# EAGLE design Science_Board (EAGLE 6.6.0)
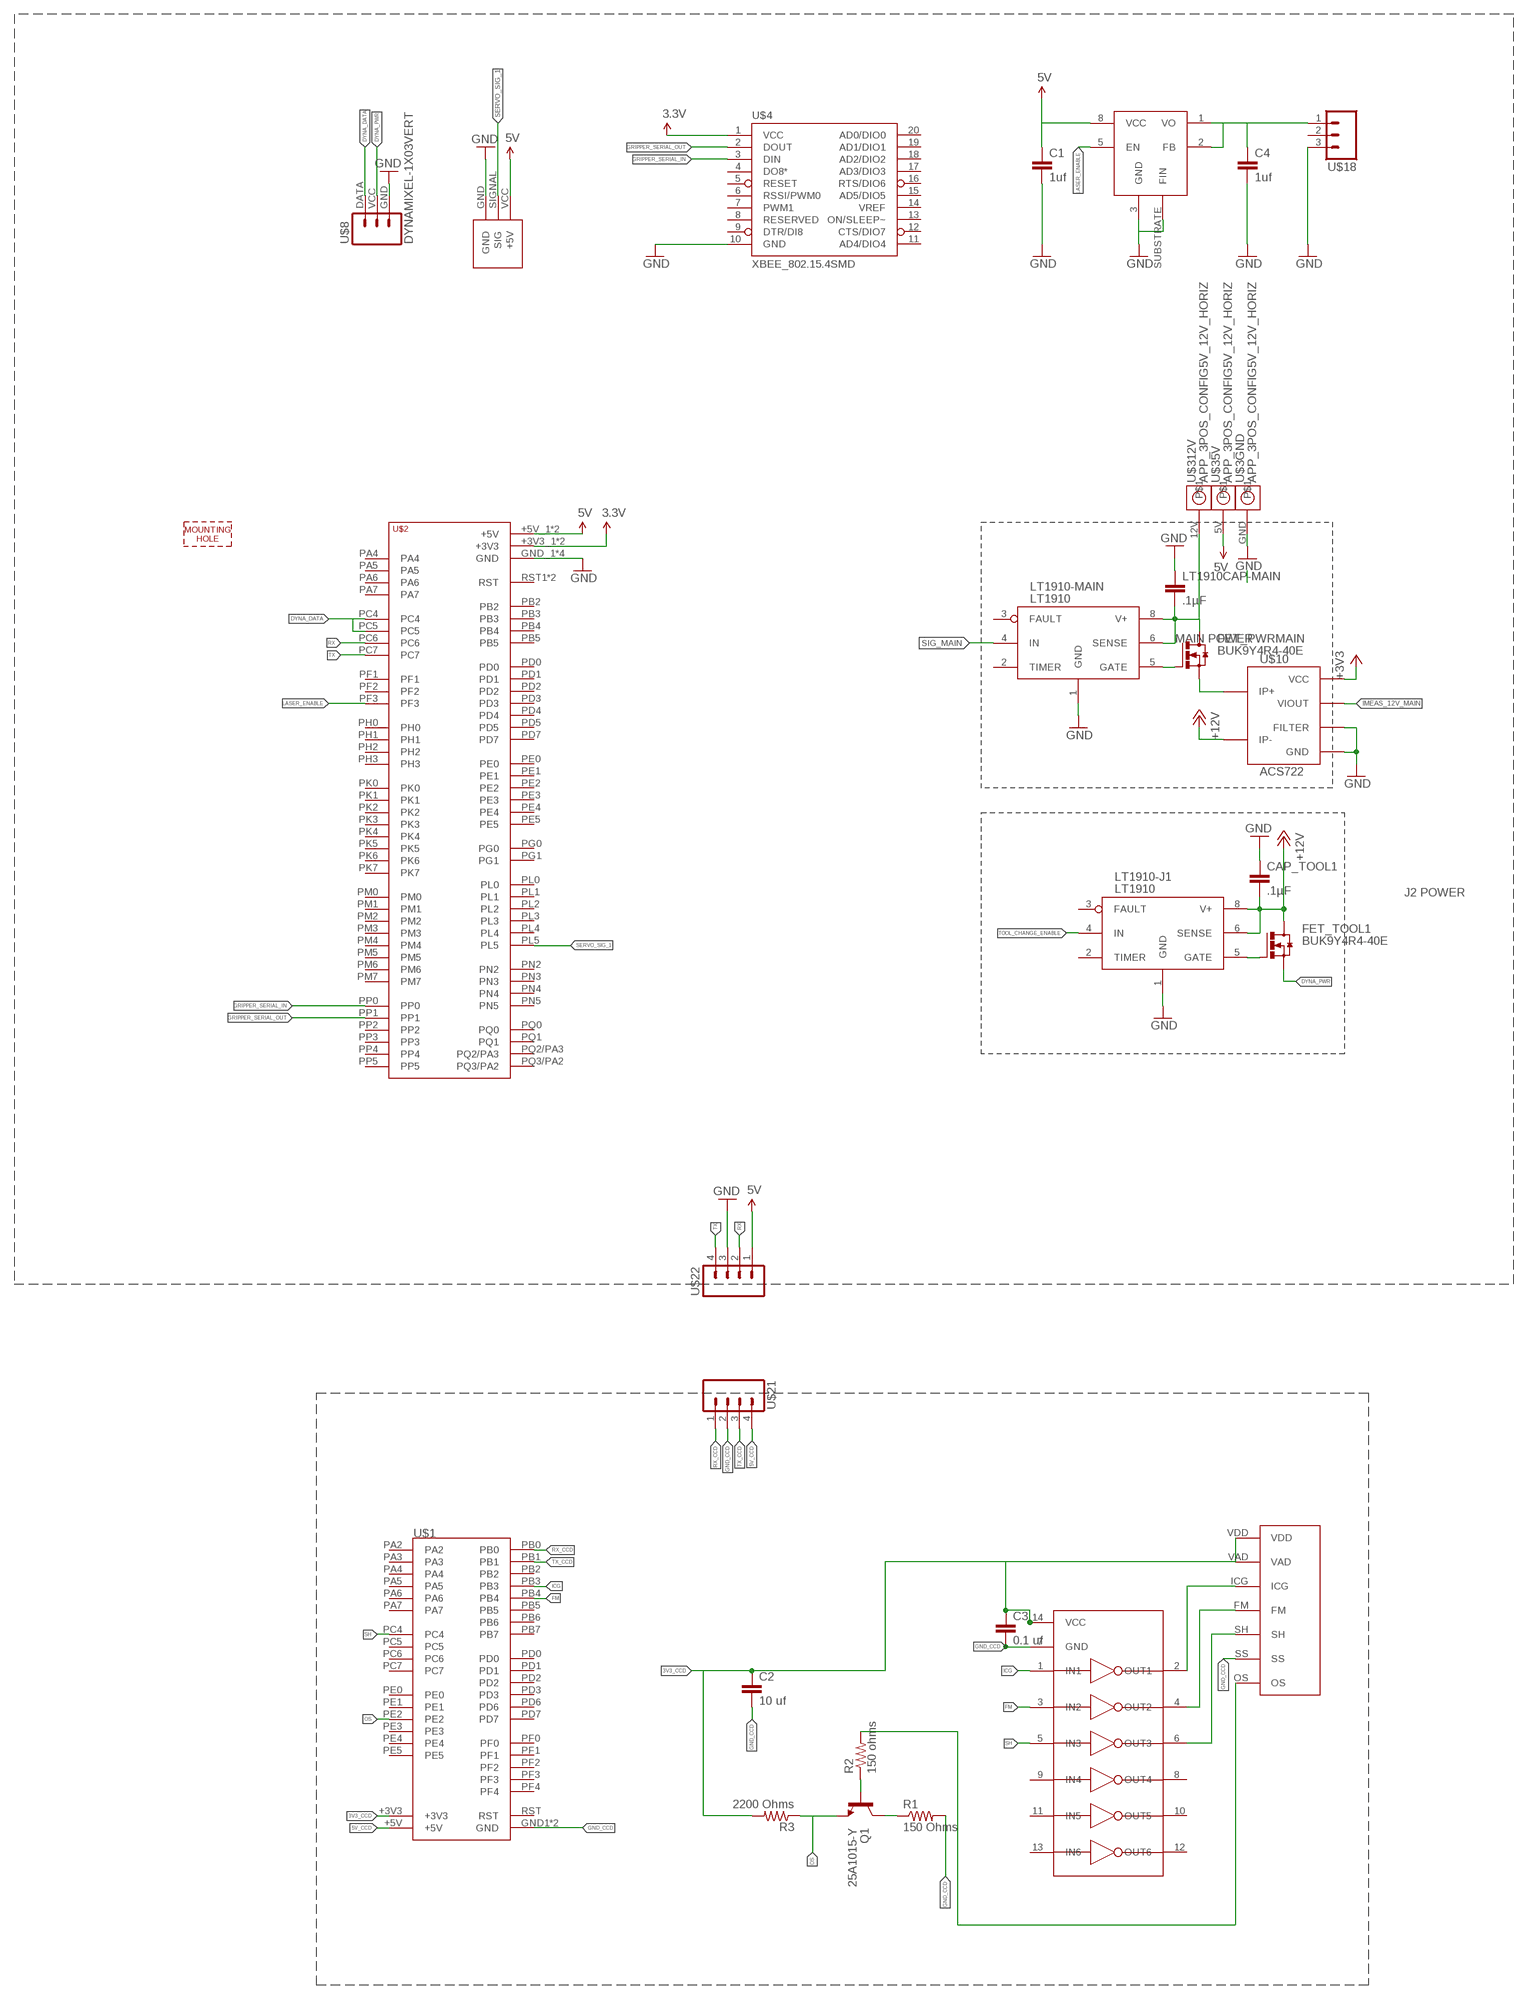
[diagram p0: schematic, sheet 1]

## Parts
C1  1uf  CAP0603-CAP  [0603-CAP]
C2  10 uf  CAP0603-CAP  [0603-CAP]
C3  0.1 uf  CAP0603-CAP  [0603-CAP]
C4  1uf  CAP0603-CAP  [0603-CAP]
CAP_TOOL1  .1µF  CAP0603-CAP  [0603-CAP]
FET_PWRMAIN  BUK9Y4R4-40E  [POWER-S08-BUK]
FET_TOOL1  BUK9Y4R4-40E  [POWER-S08-BUK]
LT1910-J1  LT1910  [SO8]
LT1910-MAIN  LT1910  [SO8]
LT1910CAP-MAIN  .1µF  CAP0603-CAP  [0603-CAP]
Q1  25A1015-Y  TRANSISTOR_NPNBC547  [TO-92-AMMO]
R1  150 Ohms  RESISTOR0603-RES  [0603-RES]
R2  150 ohms  RESISTOR0603-RES  [0603-RES]
R3  2200 Ohms  RESISTOR0603-RES  [0603-RES]
U$1  TIVA-C  [TIVA-C]
U$2  TIVA-C-CONNECTED  [TIVA-C-CONNECTED]
U$3  APP_3POS_CONFIG5V_12V_HORIZ  [APP45_5V_12V_HORIZ_CONFIG]
U$4  XBEE_802.15.4SMD  [XBEE_802.15.4_SMD]
U$6  MOUNTING_HOLE#8  [#8_SCREW]
U$8  DYNAMIXEL-1X03VERT  [MLX-SPOX5267-3PIN]
U$9  3V_LDO_REGULATOR  [SO8]
U$10  ACS722  [SO-08]
U$11  TC74HC04AP  [DIP14]
U$12  TCD1304DG  [CCD_PACKAGE]
U$17  SERVO  [SERVO_JACK]
U$18  M03  [MOLEX_0436500300]
U$21  M04  [MOLEX_0436500400]
U$22  M04  [MOLEX_0436500400]

## Nets
3.3V: U$2.+3V3_1(+3V3) U$2.+3V3_2(+3V3) U$4.1(VCC)
3V3_CCD: C2.1 C3.1 R3.2 U$1.+3V3 U$11.14(VCC) U$12.VAD U$12.VDD
3V_REGULATED: C4.1 U$9.1(VO) U$9.2(FB) U$18.1
5V: U$22.1
5V_CCD: U$1.+5V U$21.4
+3V3: U$10.8(VCC)
+5V: C1.1 U$2.+5V_1(+5V) U$2.+5V_2(+5V) U$3.5V U$9.8(VCC) U$17.VCC(+5V) ; supply symbol labelled 5V
+12V: CAP_TOOL1.2 FET_TOOL1.5(D) LT1910-J1.6(SENSE) LT1910-J1.8(V+) U$10.3(IP-) U$10.4(IP-)
DYNA_DATA: U$2.PC4 U$2.PC5 U$8.DATA
DYNA_PWR: FET_TOOL1.1(S) FET_TOOL1.2(S) FET_TOOL1.3(S) U$8.VCC
FM: U$1.PB4 U$11.3(IN2)
GATE-J1: FET_TOOL1.4(G) LT1910-J1.5(GATE)
GATE-MAIN: FET_PWRMAIN.4(G) LT1910-MAIN.5(GATE)
GND: C1.2 C4.2 CAP_TOOL1.1 LT1910-J1.1(GND) LT1910-MAIN.1(GND) LT1910CAP-MAIN.1 U$2.GND_1(GND) U$2.GND_2(GND) U$2.GND_3(GND) U$2.GND_4(GND) U$3.GND U$4.10(GND) U$8.GND U$9.3(GND) U$9.SUBSTRATE(FIN) U$10.5(GND) U$10.6(FILTER) U$17.GND U$18.3 U$22.3
GND_CCD: C2.2 C3.2 R1.2 U$1.GND1(GND) U$1.GND2(GND) U$11.7(GND) U$12.SS U$21.2
GRIPPER_SERIAL_IN: U$2.PP0 U$4.3(DIN)
GRIPPER_SERIAL_OUT: U$2.PP1 U$4.2(DOUT)
ICG: U$1.PB3 U$11.1(IN1)
IMEAS_12V_MAIN: U$10.7(VIOUT)
LASER_ENABLE: U$2.PF3 U$9.5(EN)
N$2: FET_PWRMAIN.5(D) LT1910-MAIN.6(SENSE) LT1910-MAIN.8(V+) LT1910CAP-MAIN.2 U$3.12V
N$4: Q1.1(C) R1.1
N$5: Q1.2(B) R2.1
N$9: U$11.2(OUT1) U$12.ICG
N$10: U$11.4(OUT2) U$12.FM
N$11: U$11.6(OUT3) U$12.SH
N$12: R2.2 U$12.OS
OS: Q1.3(E) R3.1 U$1.PE2
RX: U$2.PC6 U$22.2
RX_CCD: U$1.PB0 U$21.1
SERVO_SIG_1: U$2.PL5 U$17.SIGNAL(SIG)
SH: U$1.PC4 U$11.5(IN3)
SIG_MAIN: LT1910-MAIN.4(IN)
SOURCE-MAIN: FET_PWRMAIN.1(S) FET_PWRMAIN.2(S) FET_PWRMAIN.3(S) U$10.1(IP+) U$10.2(IP+)
TOOL_CHANGE_ENABLE: LT1910-J1.4(IN)
TX: U$2.PC7 U$22.4
TX_CCD: U$1.PB1 U$21.3
Unconnected: LT1910-J1.2(TIMER) LT1910-J1.3(FAULT) LT1910-MAIN.2(TIMER) LT1910-MAIN.3(FAULT) U$1.PA2 U$1.PA3 U$1.PA4 U$1.PA5 U$1.PA6 U$1.PA7 U$1.PB2 U$1.PB5 U$1.PB6 U$1.PB7 U$1.PC5 U$1.PC6 U$1.PC7 U$1.PD0 U$1.PD1 U$1.PD2 U$1.PD3 U$1.PD6 U$1.PD7 U$1.PE0 U$1.PE1 U$1.PE3 U$1.PE4 U$1.PE5 U$1.PF0 U$1.PF1 U$1.PF2 U$1.PF3 U$1.PF4 U$2.PA4 U$2.PA5 U$2.PA6 U$2.PA7 U$2.PB2 U$2.PB3 U$2.PB4 U$2.PB5 U$2.PD0 U$2.PD1 U$2.PD2 U$2.PD3 U$2.PD4 U$2.PD5 U$2.PD7 U$2.PE0 U$2.PE1 U$2.PE2 U$2.PE3 U$2.PE4 U$2.PE5 U$2.PF1 U$2.PF2 U$2.PG0 U$2.PG1 U$2.PH0 U$2.PH1 U$2.PH2 U$2.PH3 U$2.PK0 U$2.PK1 U$2.PK2 U$2.PK3 U$2.PK4 U$2.PK5 U$2.PK6 U$2.PK7 U$2.PL0 U$2.PL1 U$2.PL2 U$2.PL3 U$2.PL4 U$2.PM0 U$2.PM1 U$2.PM2 U$2.PM3 U$2.PM4 U$2.PM5 U$2.PM6 U$2.PM7 U$2.PN2 U$2.PN3 U$2.PN4 U$2.PN5 U$2.PP2 U$2.PP3 U$2.PP4 U$2.PP5 U$2.PQ0 U$2.PQ1 U$2.PQ2/PA3 U$2.PQ3/PA2 U$2.RST1(RST) U$2.RST_2(RST) U$4.4(DO8*) U$4.5(RESET) U$4.6(RSSI/PWM0) U$4.7(PWM1) U$4.8(RESERVED) U$4.9(DTR/DI8) U$4.11(AD4/DIO4) U$4.12(CTS/DIO7) U$4.13(ON/SLEEP~) U$4.14(VREF) U$4.15(AD5/DIO5) U$4.16(RTS/DIO6) U$4.17(AD3/DIO3) U$4.18(AD2/DIO2) U$4.19(AD1/DIO1) U$4.20(AD0/DIO0) U$11.8(OUT4) U$11.9(IN4) U$11.10(OUT5) U$11.11(IN5) U$11.12(OUT6) U$11.13(IN6) U$18.2

## Notes on the sheet
- MAIN POWER
- J2 POWER

## Power pins joined to a net without a drawn wire
RST: U$1.RST

## Library data of the parts
C1-C4 = SparkFun-Passives:CAP: Capacitor Standard 0603 ceramic capacitor, and 0.1" leaded capacitor.
CAP_TOOL1 LT1910CAP-MAIN = SparkFun-Capacitors:CAP: Capacitor Standard 0603 ceramic capacitor, and 0.1" leaded capacitor.
FET_PWRMAIN FET_TOOL1 = MRDT-2015-General:BUK9Y4R4-40E: Compatible with the BUK9Y** MOSFETS made by NXP Semiconductors.
LT1910-J1 LT1910-MAIN = Jake:LT1910
Q1 = SparkFun-DiscreteSemi:TRANSISTOR_NPN: Generic NPN BJT MMBT2222A - TRANS-08049 (SOT-23, 1A 40V) MPSA42 - TRANS-09116 (SOT-23, 500mA 300V) MMBT5088LT1G - TRANS-11160 (SOT-23, 50 mA 30V) BC547 - COM-08928 <http://www.sparkfun.com/products/8928> (TO-92 45V 100mA) (1.Collector 2.Base 3.Emitter) 2N3904 - COM-00521 <http://www.sparkfun.com/products/521> (TO-92 40V 200mA) (1.Emitter 2.Base 3.Collector) P2N2222A - COM-12852 <http://www.sparkfun.com/products/12852> (TO-92 40V 600mA) (1.Collector 2.Base 3.Emitter)
R1-R3 = SparkFun-Passives:RESISTOR: Resistor Basic schematic elements and footprints for 0603, 1206, and PTH resistors.
U$1 = MRDT-2015-General:TIVA-C: TIVA-C DEV BOARD (NON-CONNECTED)
U$2 = MRDT-2015-General:TIVA-C-CONNECTED: TIVA C CONNECTED LAUNCHPAD
U$3 = MRDT-Connectors:APP_3POS_CONFIG; COLOR1: YELLOW; COLOR2: RED; COLOR3: BLACK
U$4 = MRDT-RF:XBEE_802.15.4
U$6 = MRDT-Hardware:MOUNTING_HOLE: Mounting hole for M6 bolt. Standard use mounting hole for: Tiva C Connected - M6 Anderson Powerpole Mounting Wing - M8 Most frame-mounted PCB's - M8
U$8 = MRDT-2015-Arm:DYNAMIXEL-1X03; MFR: Molex; MFR_PN: 0022035035; ORIENT: Vert
U$9 = MRDT-2015-General:3V_LDO_REGULATOR
U$10 = MRDT-PowerICs:ACS722
U$11 = MRDT-2015-General:TC74HC04AP
U$12 = MRDT-2015-General:TCD1304DG
U$17 = MRDT-2015-General:SERVO
U$18 = MRDT-Connectors:M03
U$21 U$22 = MRDT-Connectors:M04

## Board
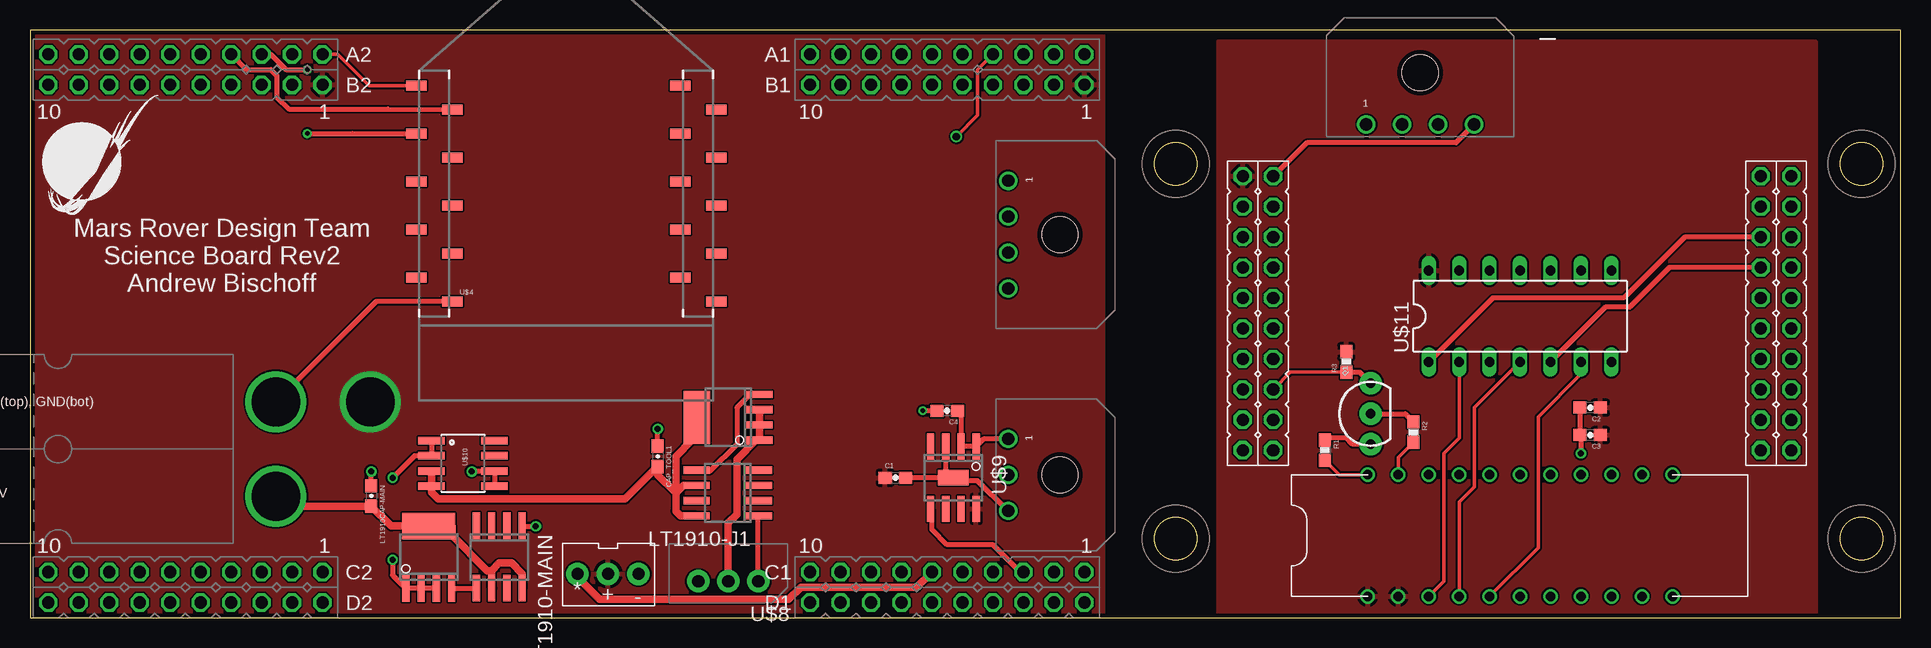
[diagram p1: board, top side]
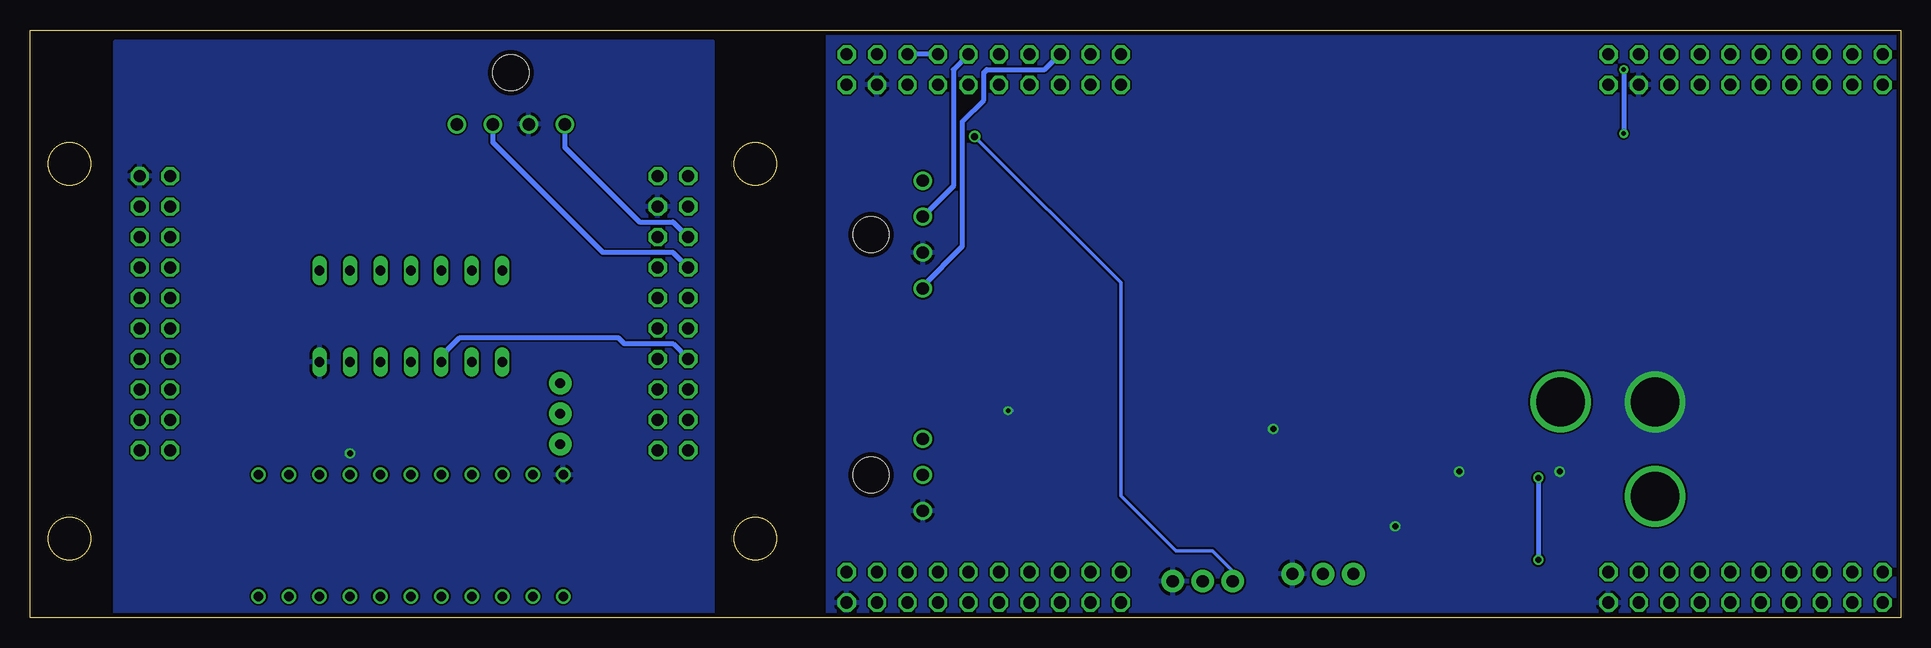
[diagram p2: board, bottom side, seen from below]

Size 155.96 x 49.02 mm. Coordinates in mm from the lower left corner, seen from the top.
Outline: 0,0 155.96,0 155.96,49.02 0,49.02 0,0
Copper layers (1*16): Top 0.0356mm / dielectric 1.5011mm / Bottom 0.0356mm
Design rules "LaenPCBOrder": minimum track width 6mil, minimum drill 13mil, track to track 6mil, track to pad 6mil, pad to pad 6mil, via to via 6mil, smd to smd 6mil, copper to edge 15mil, drill to drill 6mil, minimum pad ring 7mil, minimum via ring 7mil, stop-mask expansion 3mil, vias tented up to drill 0mil, thermal gap 10mil

### Footprints (pad centres in the part's own frame; a part is rotated, then mirrored left to right if it is on the bottom)
0603-CAP = smd 1.1 x 1: 1 -0.85,0; 2 0.85,0
POWER-S08-BUK = smd 0.6 x 2.2: 1 0.595,-0.6; 2 1.865,-0.6; 3 3.135,-0.6; 4 4.405,-0.6 | smd 4.41 x 2.2: 5 2.5,4.6
SO8 = smd 0.6 x 2.2: 1 -1.905,-2.6; 2 -0.635,-2.6; 3 0.635,-2.6; 4 1.905,-2.6; 5 1.905,2.6; 6 0.635,2.6; 7 -0.635,2.6; 8 -1.905,2.6
TO-92-AMMO = drill 0.813 pad 1.88: 1 -2.54,0; 2 0,0; 3 2.54,0
0603-RES = smd 1.1 x 1: 1 -0.85,0; 2 0.85,0
TIVA-C = drill 1.016 octagon: +3V3 30.48,2.54; +5V 30.48,5.08; GND1 33.02,5.08; GND2 30.48,48.26; PA2 53.34,48.26; PA3 50.8,48.26; PA4 48.26,48.26; PA5 48.26,2.54; PA6 50.8,2.54; PA7 53.34,2.54; PB0 35.56,2.54; PB1 38.1,2.54; PB2 33.02,48.26; PB3 35.56,45.72; PB4 45.72,2.54; PB5 33.02,2.54; PB6 45.72,48.26; PB7 43.18,48.26; PC4 38.1,45.72; PC5 40.64,45.72; PC6 43.18,45.72; PC7 45.72,45.72; PD0 35.56,5.08; PD1 38.1,5.08; PD2 40.64,5.08; PD3 43.18,5.08; PD6 48.26,45.72; PD7 50.8,45.72; PE0 35.56,48.26; PE1 45.72,5.08; PE2 48.26,5.08; PE3 50.8,5.08; PE4 40.64,2.54; PE5 43.18,2.54; PF0 38.1,48.26; PF1 53.34,5.08; PF2 30.48,45.72; PF3 33.02,45.72; PF4 53.34,45.72; RST 40.64,48.26
TIVA-C-CONNECTED = drill 1.016 octagon: +3V3_1 59.69,54.61; +3V3_2 123.19,54.61; +5V_1 59.69,52.07; +5V_2 123.19,52.07; GND_1 57.15,52.07; GND_2 59.69,8.89; GND_3 120.65,52.07; GND_4 123.19,8.89; PA4 39.37,52.07; PA5 36.83,52.07; PA6 105.41,52.07; PA7 52.07,8.89; PB2 102.87,54.61; PB3 100.33,54.61; PB4 54.61,52.07; PB5 52.07,52.07; PC4 118.11,54.61; PC5 115.57,54.61; PC6 113.03,54.61; PC7 105.41,54.61; PD0 107.95,8.89; PD1 110.49,8.89; PD2 57.15,54.61; PD3 107.95,54.61; PD4 49.53,54.61; PD5 46.99,54.61; PD7 107.95,52.07; PE0 118.11,52.07; PE1 115.57,52.07; PE2 113.03,52.07; PE3 110.49,52.07; PE4 120.65,54.61; PE5 110.49,54.61; PF1 123.19,11.43; PF2 120.65,11.43; PF3 118.11,11.43; PG0 115.57,11.43; PG1 59.69,11.43; PH0 44.45,11.43; PH1 41.91,11.43; PH2 118.11,8.89; PH3 115.57,8.89; PK0 49.53,52.07; PK1 46.99,52.07; PK2 44.45,52.07; PK3 41.91,52.07; PK4 57.15,11.43; PK5 54.61,11.43; PK6 39.37,11.43; PK7 36.83,11.43; PL0 107.95,11.43; PL1 105.41,11.43; PL2 102.87,11.43; PL3 100.33,11.43; PL4 113.03,11.43; PL5 110.49,11.43; PM0 52.07,11.43; PM1 49.53,11.43; PM2 46.99,11.43; PM3 120.65,8.89; PM4 102.87,52.07; PM5 100.33,52.07; PM6 36.83,8.89; PM7 57.15,8.89; PN2 105.41,8.89; PN3 102.87,8.89; PN4 36.83,54.61; PN5 39.37,54.61; PP0 54.61,54.61; PP1 52.07,54.61; PP2 100.33,8.89; PP3 41.91,8.89; PP4 41.91,54.61; PP5 54.61,8.89; PQ0 44.45,54.61; PQ1 39.37,8.89; PQ2/PA3 46.99,8.89; PQ3/PA2 44.45,8.89; RST1 49.53,8.89; RST_2 113.03,8.89
APP45_5V_12V_HORIZ_CONFIG = drill 4.064: 5V 36.068,11.811; 12V 28.194,3.937; GND 28.194,11.811
XBEE_802.15.4_SMD = smd 1.7 x 0.85: 1 -13.77,20; 2 -10.77,18; 3 -13.77,16; 4 -10.77,14; 5 -13.77,12; 6 -10.77,10; 7 -13.77,8; 8 -10.77,6; 9 -13.77,4; 10 -10.77,2; 11 11.23,2; 12 8.23,4; 13 11.23,6; 14 8.23,8; 15 11.23,10; 16 8.23,12; 17 11.23,14; 18 8.23,16; 19 11.23,18; 20 8.23,20
#8_SCREW = hole 4.318: 0,0
MLX-SPOX5267-3PIN = drill 1.016 pad 1.88: DATA 5,0; GND 0,0; VCC 2.5,0
SO8' = smd 0.6 x 2.2: 1 -1.905,-2.6; 2 -0.635,-2.6; 3 0.635,-2.6; 4 1.905,-2.6; 5 1.905,2.6; 6 0.635,2.6; 7 -0.635,2.6; 8 -1.905,2.6 | smd 2.54 x 1.27: SUBSTRATE 0,0
SO-08 = smd 0.61 x 2.21: 1 0.457,-0.813; 2 1.727,-0.813; 3 2.997,-0.813; 4 4.267,-0.813; 5 4.267,4.419; 6 2.997,4.419; 7 1.727,4.419; 8 0.457,4.419
DIP14 = drill 0.813 long: 1 -7.62,-3.81; 2 -5.08,-3.81; 3 -2.54,-3.81; 4 0,-3.81; 5 2.54,-3.81; 6 5.08,-3.81; 7 7.62,-3.81; 8 7.62,3.81; 9 5.08,3.81; 10 2.54,3.81; 11 0,3.81; 12 -2.54,3.81; 13 -5.08,3.81; 14 -7.62,3.81
CCD_PACKAGE = drill 0.8: FM -5.08,-3.81; ICG -7.62,-3.81; OS -10.16,6.35; P$6 0,-3.81; P$7 2.54,-3.81; P$8 5.08,-3.81; P$9 7.62,-3.81; P$10 10.16,-3.81; P$11 12.7,-3.81; P$12 12.7,6.35; P$13 10.16,6.35; P$14 7.62,6.35; P$15 5.08,6.35; P$16 2.54,6.35; P$17 0,6.35; P$18 -2.54,6.35; P$19 -5.08,6.35; P$20 -7.62,6.35; SH -2.54,-3.81; SS -12.7,6.35; VAD -10.16,-3.81; VDD -12.7,-3.81
SERVO_JACK = drill 1.016 pad 1.88: GND -4.24,3.45; SIGNAL 0.84,3.45; VCC -1.7,3.45
MOLEX_0436500300 = drill 1.016: 1 9.322,8.89; 2 6.325,8.89; 3 3.327,8.89 | hole 2.997: 6.325,4.572
MOLEX_0436500400 = drill 1.016: 1 11.049,8.89; 2 8.052,8.89; 3 5.055,8.89; 4 2.057,8.89 | hole 2.997: 6.553,4.572

### Placement (x,y rotation side)
C1  72.14,11.68 0 top
C2  130.05,17.53 180 top
C3  130.05,15.24 180 top
C4  76.45,17.27 180 top
CAP_TOOL1  52.32,13.46 270 top
FET_PWRMAIN  30.73,3.05 0 top
FET_TOOL1  60.2,14.22 90 top
LT1910-J1  58.17,10.41 90 top
LT1910-MAIN  39.12,5.08 180 top
LT1910CAP-MAIN  28.45,10.16 270 top
Q1  111.76,17.02 90 top
R1  107.95,13.97 270 top
R2  115.32,15.49 270 top
R3  109.73,21.34 90 top
U$1  98.55,67.31 270 top
U$2  -35.31,-7.62 0 top
U$3  -7.7,6.2 0 top
U$4  45.97,24.38 0 top
U$6  -6.12,64.97 0 top  (outside the outline)
U$7  [MRDT_LOGO]  1.02,32.77 0 top
U$8  60.71,3.05 180 top
U$9  3V_LDO_REGULATOR  [SO8']  76.96,11.68 180 top
U$10  34.29,15.24 270 top
U$11  124.21,25.15 0 top
U$12  124.21,5.59 0 top
U$13  [#6_SCREW]  152.65,37.85 0 top
U$14  [#6_SCREW]  152.65,6.6 0 top
U$15  [#6_SCREW]  95.5,6.6 0 top
U$16  [#6_SCREW]  95.5,37.85 0 top
U$17  46.48,7.11 180 top
U$18  90.42,5.59 90 top
U$21  122.43,50.04 180 top
U$22  90.42,25.4 90 top

### Tracks (layer width: path | path; a pad name or v marks a point on that pad's centre or on a via)
3.3V
  Top 0.305: U$4.1 28.26,44.38 25.65,46.99 U$2.+3V3_1
3V3_CCD
  pour Top: 99.06,48.01 99.06,0.25 148.84,0.25 148.84,48.01
3V_REGULATED
  Top 0.406: U$18.1 79.49,14.91 U$9.1 U$9.2 77.6,17.27 C4.1
5V_CCD
  Top 0.406: U$21.4 120.37,41.12 118.87,39.62 106.43,39.62 U$1.+5V
+5V
  pour Top: -38.86,-8.89 -38.86,52.83 89.41,52.83 89.41,-8.89
+12V
  Top 0.406: LT1910-J1.6 54.48,11.05 | 55.44,8.51 LT1910-J1.8 | 55.6,14.82 55.2,14.82 | CAP_TOOL1.2 52.32,11.94
  Top 0.61: 54.48,11.05 53.85,10.41 | 53.85,10.41 53.85,8.89 54.23,8.51 55.44,8.51 | 55.6,17.36 FET_TOOL1.5 55.6,14.82 | 55.2,14.82 53.85,13.46 53.85,10.41 | 52.32,11.94 53.85,10.41 | U$10.4 U$10.3 33.48,10.46 34.04,9.91 49.62,9.91 CAP_TOOL1.2
DYNA_DATA  (via drill 0.6)
  Top 0.305: v77.22,40.13 78.99,41.91 78.99,45.72 U$2.PC5
  Bottom 0.305: U$8.DATA 55.71,3.89 57.4,5.59 60.45,5.59 65.02,10.16 65.02,27.94 v77.22,40.13
  Bottom 0.406: U$2.PC5 U$2.PC4
DYNA_PWR
  Top 0.406: FET_TOOL1.1 60.54,14.82
  Top 0.61: 60.54,14.82 58.93,13.21 58.93,8.64 58.21,7.91 U$8.VCC | FET_TOOL1.1 FET_TOOL1.2 FET_TOOL1.3
FM
  Bottom 0.406: U$11.3 121.67,21.84 120.14,23.37 106.93,23.37 106.43,22.86 102.36,22.86 U$1.PB4
GATE-J1
  Top 0.406: FET_TOOL1.4 60.03,18.63 58.93,17.53 58.93,14.48 56.64,12.19 55.69,12.19 LT1910-J1.5
GATE-MAIN
  Top 0.406: FET_PWRMAIN.4 37.18,2.45 LT1910-MAIN.5
GND  (via drill 0.38, 0.5)
  Top 0.406: CAP_TOOL1.1 v52.32,15.75 | U$10.5 U$10.6 38.41,12.24 38.35,12.19 v36.83,12.19 | LT1910CAP-MAIN.1 v28.45,12.19 | LT1910-MAIN.1 41.09,7.68 41.15,7.62 v42.16,7.62 | U$9.3 76.33,12.32 U$9.SUBSTRATE | U$18.3 81.51,8.91 78.99,11.43 77.22,11.43 U$9.SUBSTRATE | U$9.SUBSTRATE C1.2 | U$8.GND 60.71,8.45 LT1910-J1.1 | U$4.10 28.87,26.38 U$3.GND | C4.2 v74.42,17.27
  Bottom 0.406: v52.32,15.75 52.32,16 | v28.45,12.19 28.45,12.45 | v36.83,12.19 36.58,12.19 | v42.16,7.62 42.42,7.62 | v74.42,17.27 74.17,17.27
  pour Bottom: -35.31,-17.78 89.41,-18.03 89.41,49.53 -35.31,50.8
GND_CCD  (via drill 0.5)
  Top 0.305: U$12.SS 109.13,11.94 R1.2
  Top 0.406: C3.2 C2.2 129.2,15.07 129.29,14.99 v129.29,13.72
  Bottom 0.406: v129.29,13.72 129.29,13.46
  pour Bottom: 99.06,0.25 99.06,48.01 148.84,48.01 148.84,0.25
GRIPPER_SERIAL_IN  (via drill 0.38)
  Top 0.406: U$2.PP0 20.07,46.99 21.34,45.72 v23.11,45.72 | v23.11,40.39 26.87,40.39 U$4.3
  Bottom 0.406: v23.11,45.72 v23.11,40.39
GRIPPER_SERIAL_OUT
  Top 0.406: U$2.PP1 18.03,45.72 20.07,45.72 20.57,45.21 20.57,43.43 21.59,42.42 29.84,42.42 U$4.2
ICG
  Top 0.406: U$1.PB3 137.92,31.75 132.84,26.67 121.92,26.67 U$11.1
LASER_ENABLE
  Top 0.406: U$2.PF3 82.55,3.81 80.26,6.1 76.45,6.1 75.18,7.37 75.18,8.96 U$9.5
N$2
  Top 0.61: LT1910-MAIN.6 38.48,3.94 | 38.48,3.94 39.12,4.57 40.13,4.57 41.02,3.68 LT1910-MAIN.8 | 38.48,3.94 38.1,3.94 35.18,6.86 35.18,7.61 FET_PWRMAIN.5 33.87,7.65 32.6,7.65 31.33,7.65 30.11,7.65 LT1910CAP-MAIN.2 21.32,9.31 U$3.12V
N$4
  Top 0.406: Q1.1 110.24,14.48 109.73,14.99 108.12,14.99 R1.1
N$5
  Top 0.406: Q1.2 114.64,17.02 R2.1
N$9
  Top 0.305: U$11.2 119.13,14.99 117.86,13.72 117.86,3.05 U$12.ICG
N$10
  Top 0.305: U$12.FM 119.13,9.65 120.4,10.92 120.4,17.53 U$11.4
N$11
  Top 0.305: U$11.6 129.29,20.32 125.73,16.76 125.73,5.84 U$12.SH
N$12
  Top 0.305: U$12.OS 114.05,13.37 R2.2
OS
  Top 0.305: R3.1 105.07,20.49 U$1.PE2
  Top 0.406: R3.1 110.83,20.49 Q1.3 | 103.72,18.96 U$1.PE2
RX
  Bottom 0.406: U$2.PC6 78.99,45.72 78.99,35.99 U$22.2
RX_CCD
  Bottom 0.406: U$21.1 111.38,39.24 105.16,33.02 102.36,33.02 U$1.PB0
SERVO_SIG_1
  Top 0.61: U$17.SIGNAL 45.64,3.38 47.5,1.52 63.25,1.52 64.26,2.54 73.91,2.54 U$2.PL5
SH
  Top 0.406: U$1.PC4 136.65,29.21 133.35,25.91 131.32,25.91 U$11.5
SOURCE-MAIN  (via drill 0.5)
  Top 0.406: U$10.1 U$10.2 32.06,13.51 v30.23,11.68 | FET_PWRMAIN.3 FET_PWRMAIN.2 FET_PWRMAIN.1 30.23,3.55 v30.23,4.83
  Bottom 0.406: v30.23,11.68 v30.23,4.83
TX
  Bottom 0.406: U$22.4 81.53,27.69 78.23,30.99 78.23,41.4 76.45,43.18 76.45,45.47 76.2,45.72 71.37,45.72 U$2.PC7
TX_CCD
  Bottom 0.406: 117.35,41.15 U$21.3 117.37,39.65 108.2,30.48 102.36,30.48 U$1.PB1

### Text on the board
tPlace: Mars Rover Design Team / Science Board Rev2 / Andrew Bischoff